# EAGLE design M160C (EAGLE 6.6.0)
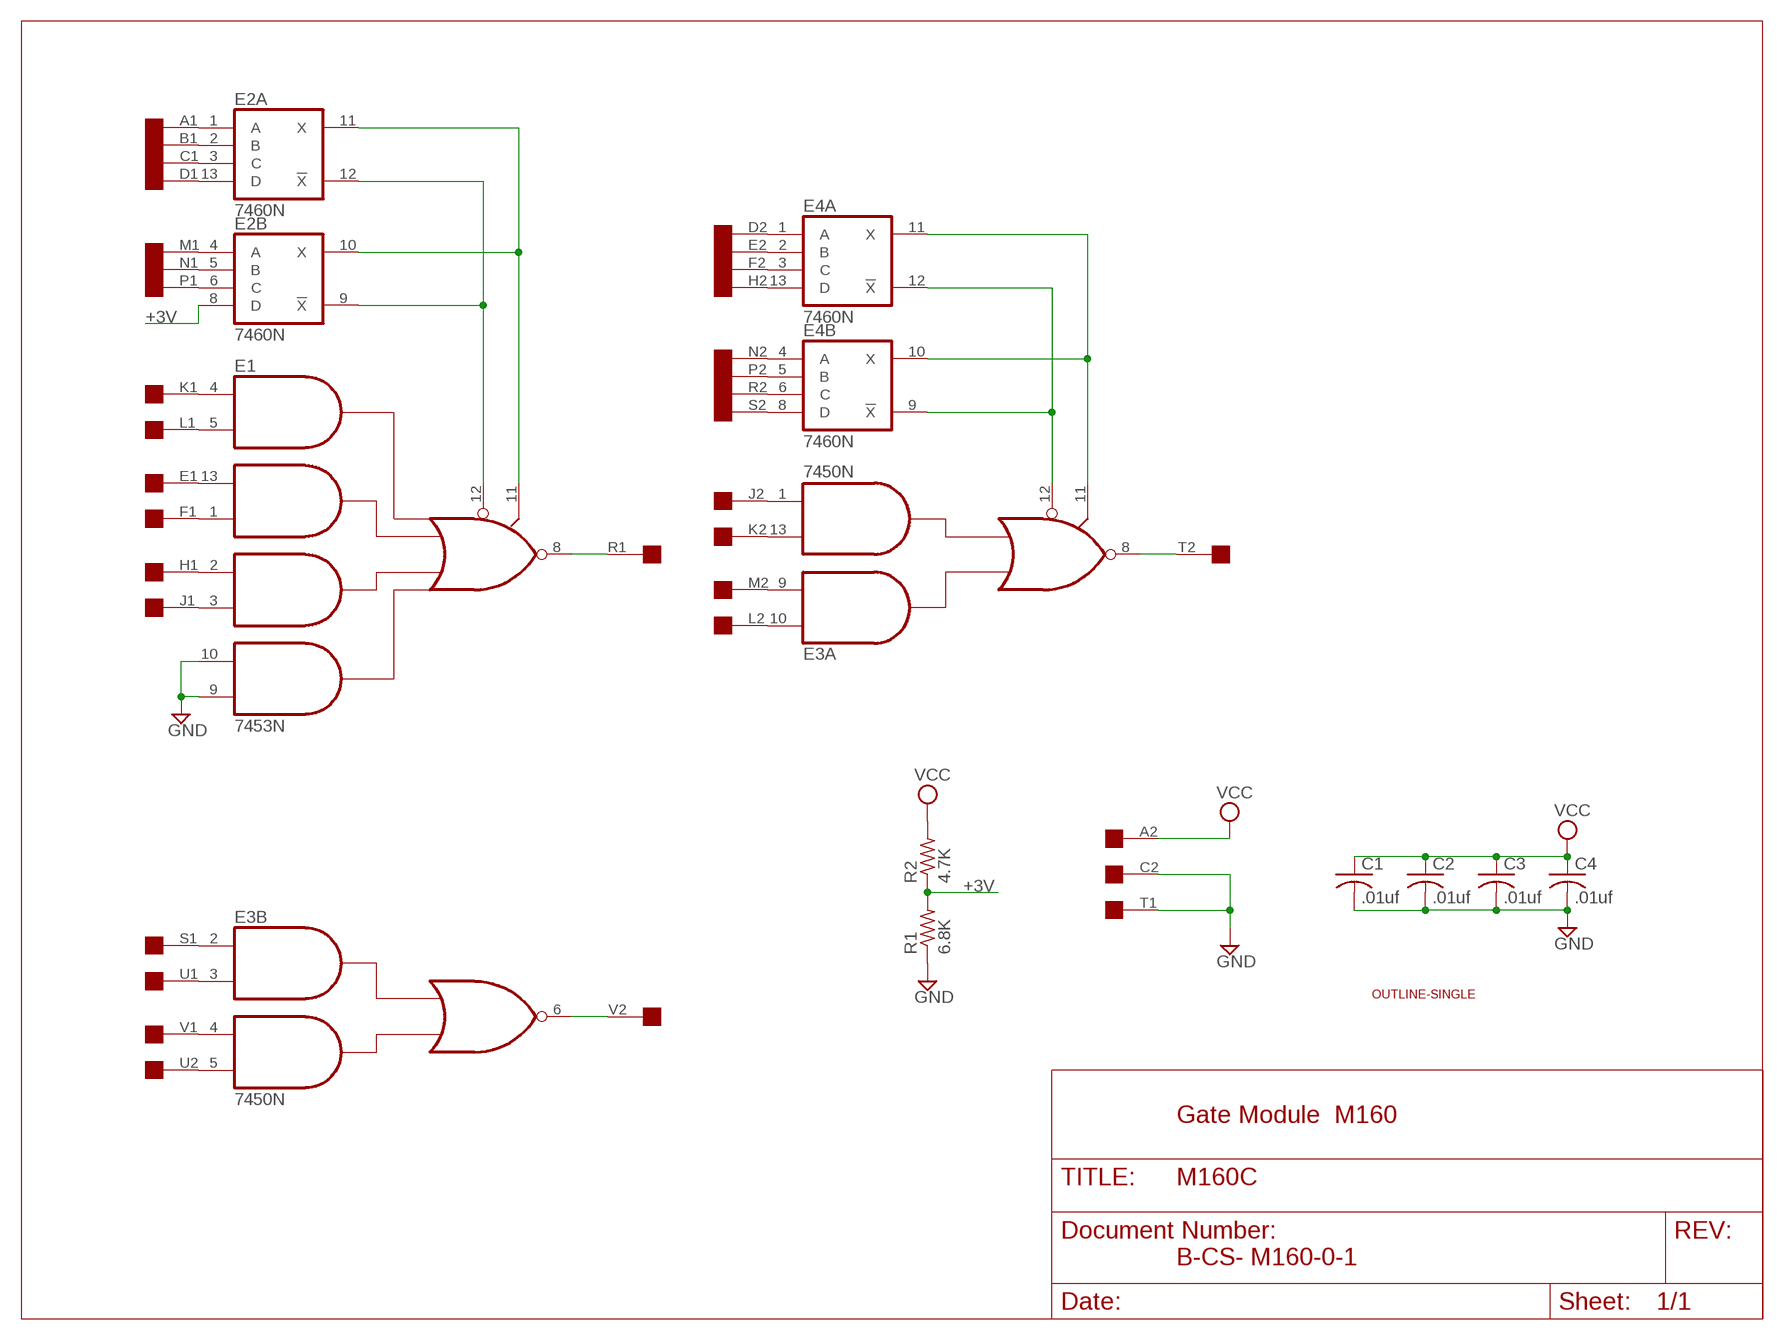
[diagram p0: schematic, sheet 1]

## Parts
C1  .01uf  C-US050-025X075  [C050-025X075]
C2  .01uf  C-US050-025X075  [C050-025X075]
C3  .01uf  C-US050-025X075  [C050-025X075]
C4  .01uf  C-US050-025X075  [C050-025X075]
E1  7453N  [DIL14]
E2  7460N  [DIL14]
E3  7450N  [DIL14]
E4  7460N  [DIL14]
R1  6.8K  R-US_0207/10  [0207/10]
R2  4.7K  R-US_0207/10  [0207/10]
U$1  OUTLINE-SINGLE  [SINGLE]
U$4  SINGLE  [EDGE-CON2]

## Nets
+3V: E2.8(B:D) R1.2 R2.1
GND [Supply]: C1.2 C2.2 C3.2 C4.2 E1.9(I8) E1.10(I7) R1.1 U$4.C2 U$4.T1
N$1: E1.11(I10) E2.10(B:X) E2.11(A:X)
N$2: E1.13(I3) U$4.E1
N$3: E1.1(I4) U$4.F1
N$4: E1.2(I5) U$4.H1
N$5: E1.3(I6) U$4.J1
N$6: E1.4(I1) U$4.K1
N$7: E1.5(I2) U$4.L1
N$8: E1.12(I9) E2.9(B:!X) E2.12(A:!X)
N$9: E2.1(A:A) U$4.A1
N$10: E2.2(A:B) U$4.B1
N$11: E2.3(A:C) U$4.C1
N$12: E2.13(A:D) U$4.D1
N$13: E2.6(B:C) U$4.P1
N$14: E2.5(B:B) U$4.N1
N$15: E2.4(B:A) U$4.M1
N$16: E1.8(O) U$4.R1
N$17: E3.10(A:I1) U$4.L2
N$18: E3.9(A:I2) U$4.M2
N$19: E3.13(A:I3) U$4.K2
N$20: E3.1(A:I4) U$4.J2
N$21: E3.12(A:I5) E4.9(B:!X) E4.12(A:!X)
N$22: E3.11(A:I6) E4.10(B:X) E4.11(A:X)
N$23: E4.3(A:C) U$4.F2
N$24: E4.2(A:B) U$4.E2
N$25: E4.1(A:A) U$4.D2
N$26: E4.13(A:D) U$4.H2
N$27: E4.4(B:A) U$4.N2
N$28: E4.6(B:C) U$4.R2
N$29: E4.8(B:D) U$4.S2
N$30: E4.5(B:B) U$4.P2
N$31: E3.8(A:O) U$4.T2
N$32: E3.2(B:I1) U$4.S1
N$33: E3.5(B:I4) U$4.U2
N$34: E3.4(B:I3) U$4.V1
N$35: E3.3(B:I2) U$4.U1
N$36: E3.6(B:O) U$4.V2
VCC [Supply]: C1.1 C2.1 C3.1 C4.1 R2.2 U$4.A2
Unconnected: E1.6(SPARE) U$4.B2

## Notes on the sheet
- Gate Module  M160
- B-CS- M160-0-1

## Power pins joined to a net without a drawn wire
GND: E1.7(GND) E2.7(P:GND) E3.7(P:GND) E4.7(P:GND)
VCC: E1.14(VCC) E2.14(P:VCC) E3.14(P:VCC) E4.14(P:VCC)

## Library data of the parts
C1-C4 = rcl:C-US: CAPACITOR, American symbol
E1 = dec-con:74*53: 4-2-3-2 input AND OR INVERTER gates
E2 E4 = 74xx-us:74*60: Dual 4-input EXPANDER
E3 = dec-con:74*50: 4-2-3-2 input AND OR INVERTER gates
R1 R2 = rcl:R-US_: RESISTOR, American symbol
U$1 = dec-con:OUTLINE-*: Board outlines for DEC boards.
U$4 = dec-con:SINGLE: Single-Height DEC board

## Net classes
1 Supply: width 0.813 mm

## Board
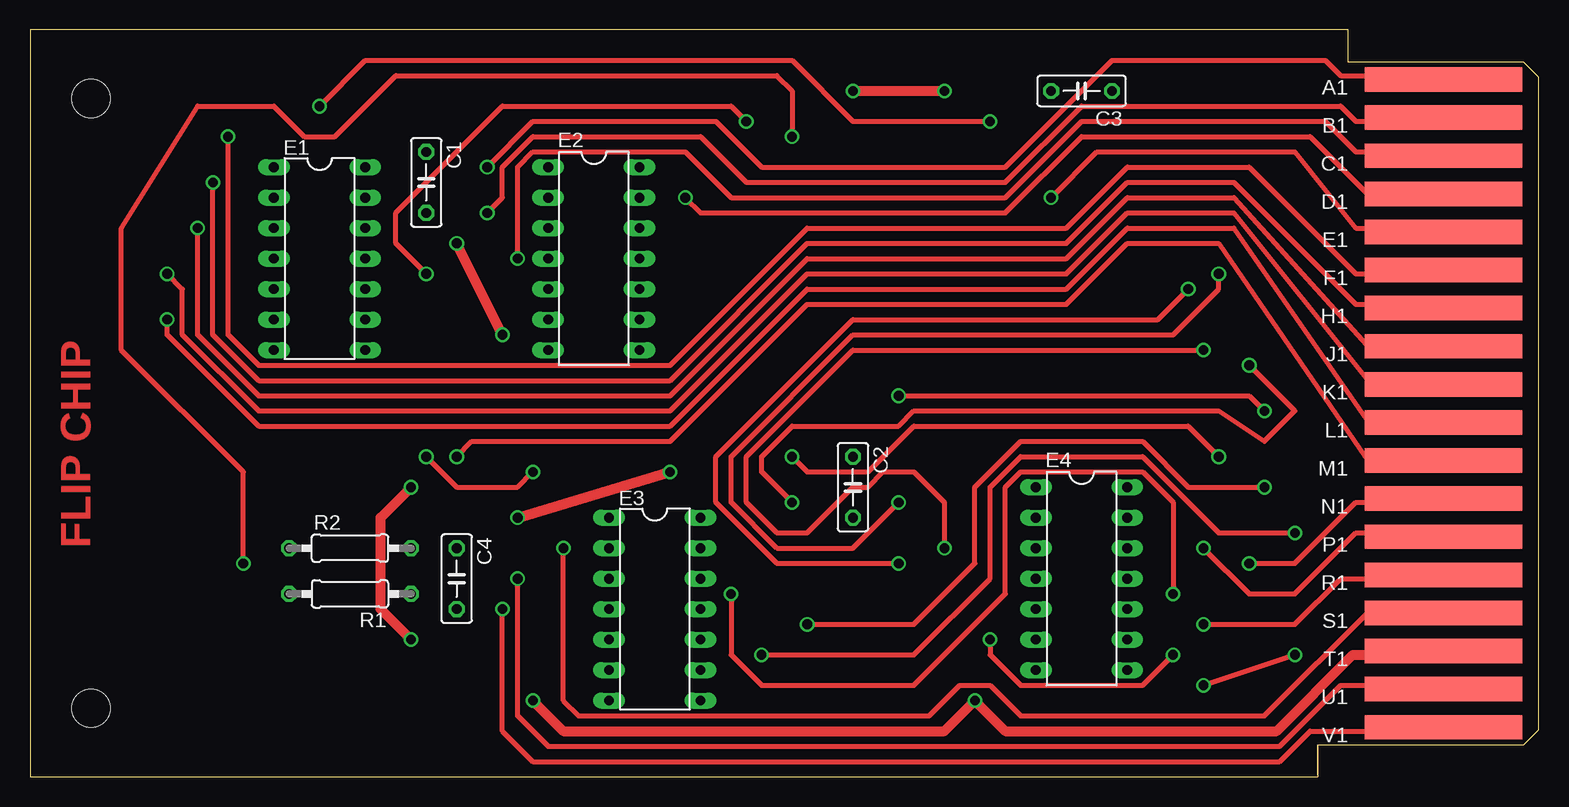
[diagram p1: board, top side]
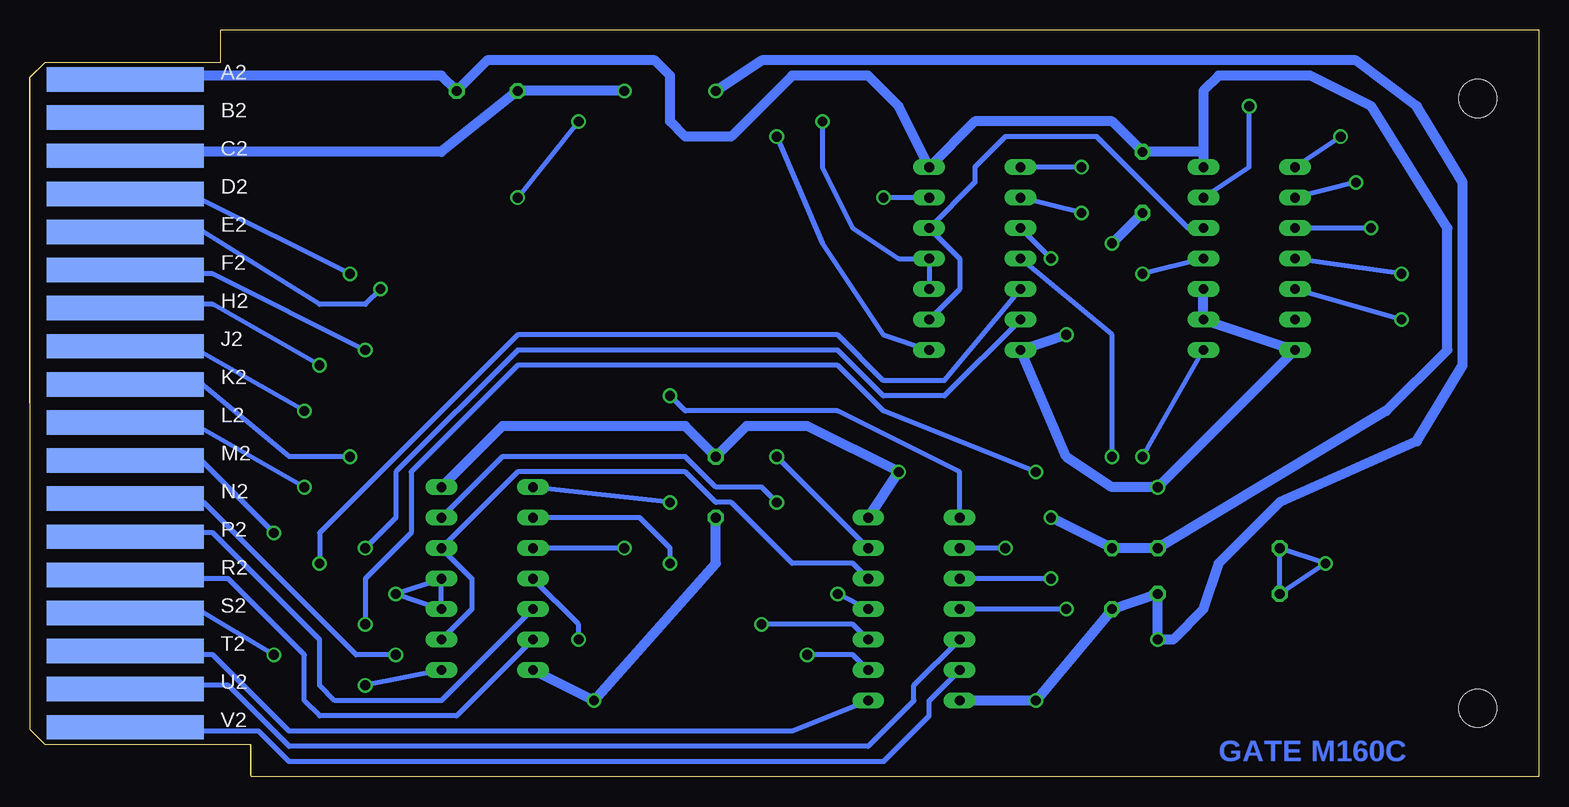
[diagram p2: board, bottom side, seen from below]

Size 125.73 x 62.23 mm. Coordinates in mm from the lower left corner, seen from the top.
Copper layers (1+16): Top 0.035mm / dielectric 1.5mm / Bottom 0.035mm
Design rules "16mils": minimum track width 16mil, minimum drill 32mil, track to track 15mil, track to pad 10mil, pad to pad 10mil, via to via 10mil, smd to smd 10mil, copper to edge 13mil, drill to drill 10mil, minimum pad ring 10mil, minimum via ring 8mil, stop-mask expansion 0mil, vias tented up to drill 0mil, thermal gap 10mil

### Footprints (pad centres in the part's own frame; a part is rotated, then mirrored left to right if it is on the bottom)
C050-025X075 = drill 0.813 octagon: 1 -2.54,0; 2 2.54,0
DIL14 = drill 0.813 long: 1 -7.62,-3.81; 2 -5.08,-3.81; 3 -2.54,-3.81; 4 0,-3.81; 5 2.54,-3.81; 6 5.08,-3.81; 7 7.62,-3.81; 8 7.62,3.81; 9 5.08,3.81; 10 2.54,3.81; 11 0,3.81; 12 -2.54,3.81; 13 -5.08,3.81; 14 -7.62,3.81
0207/10 = drill 0.813 octagon: 1 -5.08,0; 2 5.08,0
SINGLE = hole 3.175: 120.65,56.515; 120.65,5.715
EDGE-CON2 = smd 13.106 x 2.032: A1 7.938,4.128; B1 7.938,7.303; C1 7.938,10.477; D1 7.938,13.652; E1 7.938,16.828; F1 7.938,20.003; H1 7.938,23.177; J1 7.938,26.352; K1 7.938,29.527; L1 7.938,32.703; M1 7.938,35.877; N1 7.938,39.053; P1 7.938,42.227; R1 7.938,45.403; S1 7.938,48.578; T1 7.938,51.752; U1 7.938,54.928; V1 7.938,58.102 | smd 13.106 x 2.032 bottom: A2 7.938,4.128; B2 7.938,7.303; C2 7.938,10.477; D2 7.938,13.652; E2 7.938,16.828; F2 7.938,20.003; H2 7.938,23.177; J2 7.938,26.352; K2 7.938,29.527; L2 7.938,32.703; M2 7.938,35.877; N2 7.938,39.053; P2 7.938,42.227; R2 7.938,45.403; S2 7.938,48.578; T2 7.938,51.752; U2 7.938,54.928; V2 7.938,58.102

### Placement (x,y rotation side)
C1  33.02,49.53 270 top
C2  68.58,24.13 270 top
C3  87.63,57.15 180 top
C4  35.56,16.51 270 top
E1  24.13,43.18 270 top
E2  46.99,43.18 270 top
E3  52.07,13.97 270 top
E4  87.63,16.51 270 top
R1  26.67,15.24 180 top
R2  26.67,19.05 0 top
U$1  125.73,62.23 180 top
U$2  [FLIPCHIP]  0,0 0 top
U$4  125.73,62.23 180 top

### Tracks (layer width: path | path; a pad name or v marks a point on that pad's centre or on a via)
+3V  (via drill 0.81)
  Top 0.406: v63.5,53.34 63.5,57.15 62.23,58.42 30.48,58.42 25.4,53.34 22.86,53.34 20.32,55.88 13.97,55.88 7.62,45.72 7.62,35.56 17.78,25.4 v17.78,17.78
  Bottom 0.406: E2.8 54.61,36.83 59.69,44.45 v63.5,53.34 | R1.2 v17.78,17.78 R2.1 R1.2
GND  (via drill 0.81)
  Top 0.813: v68.58,57.15 v76.2,57.15 | v39.37,36.83 v35.56,44.45 | v31.75,24.13 29.21,21.59 29.21,13.97 v31.75,11.43 | v41.91,6.35 44.45,3.81 76.2,3.81 v78.74,6.35 81.28,3.81 103.89,3.81 110.24,10.16 116.84,10.16 U$4.T1
  Bottom 0.813: U$4.C2 117.78,52.07 91.44,52.07 C3.2 v76.2,57.15 | v68.58,57.15 64.77,59.69 15.24,59.69 10.16,55.88 6.35,49.53 6.35,34.29 10.16,27.94 21.59,22.86 26.67,17.78 27.94,13.97 30.48,11.43 v31.75,11.43 R1.1 C4.2 v41.91,6.35 E3.7 | E1.10 E1.9 E1.7 v31.75,24.13 35.56,24.13 39.37,26.67 E2.7 v39.37,36.83 | v35.56,44.45 C1.2 | E4.7 v78.74,6.35 68.58,17.78 C2.2
N$1  (via drill 0.81)
  Top 0.406: v33.02,41.91 30.48,44.45 30.48,46.99 39.37,55.88 58.42,55.88 v59.69,54.61
  Bottom 0.406: E1.11 v33.02,41.91 | v59.69,54.61 59.69,50.8 57.15,45.72 53.34,43.18 E2.11 E2.10
N$2  (via drill 0.81)
  Top 0.406: v24.13,55.88 27.94,59.69 63.5,59.69 68.58,54.61 v80.01,54.61 | v85.09,48.26 88.9,52.07 105.41,52.07 110.49,45.72 116.84,45.72 U$4.E1
  Bottom 0.406: E1.13 24.13,50.8 v24.13,55.88 | v80.01,54.61 v85.09,48.26
N$3  (via drill 0.81)
  Top 0.406: v16.51,53.34 16.51,36.83 19.05,34.29 53.34,34.29 64.77,45.72 86.36,45.72 91.44,50.8 101.6,50.8 110.49,41.91 116.84,41.91 U$4.F1
  Bottom 0.406: v16.51,53.34 E1.1
N$4  (via drill 0.81)
  Top 0.406: v15.24,49.53 15.24,36.83 19.05,33.02 53.34,33.02 64.77,44.45 86.36,44.45 91.44,49.53 100.33,49.53 110.49,39.37 116.84,39.37 U$4.H1
  Bottom 0.406: v15.24,49.53 E1.2
N$5  (via drill 0.81)
  Top 0.406: v13.97,45.72 13.97,36.83 19.05,31.75 53.34,31.75 64.77,43.18 86.36,43.18 91.44,48.26 100.33,48.26 111.76,35.56 115.57,35.56 U$4.J1
  Bottom 0.406: v13.97,45.72 E1.3
N$6  (via drill 0.81)
  Top 0.406: v11.43,41.91 12.7,40.64 12.7,36.83 19.05,30.48 53.34,30.48 64.77,41.91 86.36,41.91 91.44,46.99 100.33,46.99 111.51,33.02 116.84,33.02 U$4.K1
  Bottom 0.406: v11.43,41.91 E1.4
N$7  (via drill 0.81)
  Top 0.406: U$4.L1 116.84,29.21 111.76,29.21 100.33,45.72 91.44,45.72 86.36,40.64 64.77,40.64 53.34,29.21 19.05,29.21 11.43,36.83 v11.43,38.1
  Bottom 0.406: v11.43,38.1 E1.5
N$8
  Bottom 0.406: E1.12 29.21,45.72 36.83,53.34 44.45,53.34 46.99,50.8 46.99,49.53 E2.12 48.26,43.18 48.26,40.64 E2.9
N$9  (via drill 0.81)
  Top 0.406: v38.1,50.8 41.91,54.61 57.15,54.61 60.96,50.8 81.28,50.8 90.17,59.69 107.95,59.69 109.22,58.42 116.84,58.42 117.24,58.02 U$4.A1
  Bottom 0.406: v38.1,50.8 E2.1
N$10  (via drill 0.81)
  Top 0.406: v38.1,46.99 39.37,48.26 39.37,50.8 41.91,53.34 55.88,53.34 59.69,49.53 81.28,49.53 87.63,55.88 109.22,55.88 110.49,54.61 111.76,54.61 116.84,54.61 117.13,54.9 U$4.B1
  Bottom 0.406: v38.1,46.99 E2.2
N$11  (via drill 0.81)
  Top 0.406: v40.64,43.18 40.64,50.8 41.91,52.07 54.61,52.07 58.42,48.26 81.28,48.26 87.63,54.61 107.95,54.61 110.49,52.07 116.84,52.07 117.17,51.74 U$4.C1
  Bottom 0.406: v40.64,43.18 E2.3
N$12  (via drill 0.81)
  Top 0.406: v54.61,48.26 55.88,46.99 81.28,46.99 87.63,53.34 106.68,53.34 111.76,48.26 116.84,48.26 117.14,48.56 U$4.D1
  Bottom 0.406: E2.13 v54.61,48.26
N$13  (via drill 0.81)
  Top 0.406: U$4.P1 116.84,20.32 110.49,20.32 105.41,15.24 101.6,15.24 v97.79,19.05
  Bottom 0.406: v97.79,19.05 95.25,21.59 95.25,25.4 85.09,35.56 58.42,35.56 54.61,31.75 49.53,31.75 E2.6
N$14  (via drill 0.81)
  Top 0.406: U$4.N1 117.17,23.19 116.84,22.86 110.49,22.86 105.41,17.78 v101.6,17.78
  Bottom 0.406: E2.5 49.53,33.02 54.61,33.02 58.42,36.83 85.09,36.83 101.6,20.32 v101.6,17.78
N$15  (via drill 0.81)
  Top 0.406: v35.56,26.67 36.83,27.94 53.34,27.94 64.77,39.37 86.36,39.37 91.44,44.45 99.06,44.45 111.25,26.67 116.84,26.67 117.17,26.34 U$4.M1
  Bottom 0.406: E2.4 35.56,36.83 v35.56,26.67
N$16  (via drill 0.81)
  Top 0.406: v33.02,26.67 35.56,24.13 40.64,24.13 v41.91,25.4 | U$4.R1 116.84,16.51 109.22,16.51 105.41,12.7 v97.79,12.7
  Bottom 0.406: v33.02,26.67 E1.8 | v41.91,25.4 54.61,30.48 58.42,34.29 85.09,34.29 93.98,25.4 93.98,20.32 97.79,16.51 v97.79,12.7
N$17  (via drill 0.81)
  Top 0.406: v64.77,12.7 73.66,12.7 78.74,17.78 78.74,24.13 82.55,27.94 92.71,27.94 96.52,24.13 v102.87,24.13
  Bottom 0.406: E3.10 57.15,12.7 v64.77,12.7 | U$4.L2 116.84,29.21 111.76,29.21 v102.87,24.13
N$18  (via drill 0.81)
  Top 0.406: v60.96,10.16 73.66,10.16 80.01,16.51 80.01,24.13 82.55,26.67 92.71,26.67 99.06,20.32 v105.41,20.32
  Bottom 0.406: E3.9 57.15,10.16 v60.96,10.16 | U$4.M2 116.84,26.67 111.76,26.67 v105.41,20.32
N$19  (via drill 0.81)
  Top 0.406: v63.5,26.67 64.77,25.4 69.85,25.4 73.66,29.21 96.52,29.21 v99.06,26.67
  Bottom 0.406: E3.13 v63.5,26.67 | U$4.K2 116.84,33.02 111.76,33.02 104.14,26.67 v99.06,26.67
N$20  (via drill 0.81)
  Top 0.406: v102.87,30.48 101.6,31.75 v72.39,31.75
  Bottom 0.406: E3.1 48.26,25.4 58.42,30.48 71.12,30.48 v72.39,31.75 | U$4.J2 116.84,35.56 111.76,35.56 v102.87,30.48
N$21
  Bottom 0.406: E3.12 57.15,17.78 62.23,17.78 67.31,22.86 68.58,22.86 71.12,25.4 85.09,25.4 E4.12 88.9,16.51 88.9,13.97 E4.9
N$22  (via drill 0.81)
  Top 0.406: v58.42,15.24 58.42,10.16 60.96,7.62 73.66,7.62 81.28,15.24 81.28,24.13 82.55,25.4 92.71,25.4 95.25,22.86 v95.25,15.24
  Bottom 0.406: E3.11 v58.42,15.24 | E4.10 E4.11 v95.25,15.24 E4.10
N$23  (via drill 0.81)
  Top 0.406: v97.79,35.56 68.58,35.56 59.69,26.67 59.69,22.86 62.23,20.32 64.77,20.32 68.58,24.13 69.85,24.13 71.12,25.4 73.66,25.4 76.2,22.86 v76.2,19.05
  Bottom 0.406: U$4.F2 116.84,41.91 110.49,41.91 v97.79,35.56 | v76.2,19.05 E4.3
N$24  (via drill 0.81)
  Top 0.406: v96.52,40.64 93.98,38.1 68.58,38.1 57.15,26.67 57.15,22.86 62.23,17.78 v72.39,17.78
  Bottom 0.406: E4.2 74.93,21.59 72.39,19.05 v72.39,17.78 | U$4.E2 116.84,45.72 111.76,45.72 101.6,39.37 97.79,39.37 v96.52,40.64
N$25  (via drill 0.81)
  Top 0.406: v99.06,41.91 99.06,40.64 95.25,36.83 68.58,36.83 58.42,26.67 58.42,22.86 62.23,19.05 68.58,19.05 v72.39,22.86
  Bottom 0.406: v72.39,22.86 E4.1 | U$4.D2 117.78,48.26 111.76,48.26 v99.06,41.91
N$26  (via drill 0.81)
  Top 0.406: v101.6,34.29 105.41,30.48 102.87,27.94 99.06,30.48 73.66,30.48 72.39,29.21 63.5,29.21 60.96,26.67 60.96,25.4 v63.5,22.86
  Bottom 0.406: E4.13 86.36,26.67 71.12,26.67 68.58,24.13 64.77,24.13 v63.5,22.86 | U$4.H2 116.84,39.37 110.49,39.37 v101.6,34.29
N$27  (via drill 0.81)
  Top 0.406: v95.25,10.16 92.71,7.62 82.55,7.62 80.01,10.16 v80.01,11.43
  Bottom 0.406: E4.4 80.01,12.7 v80.01,11.43 | U$4.N2 116.84,22.86 111.25,22.86 98.55,10.16 v95.25,10.16
N$28
  Bottom 0.406: U$4.R2 117.76,16.51 109.22,16.51 102.87,10.16 102.87,6.35 101.6,5.08 90.17,5.08 E4.6
N$29  (via drill 0.81)
  Top 0.406: v97.79,7.62 v105.41,10.16
  Bottom 0.406: E4.8 v97.79,7.62 | U$4.S2 116.84,13.97 111.76,13.97 v105.41,10.16
N$30
  Bottom 0.406: E4.5 91.44,6.35 100.33,6.35 101.6,7.62 101.6,11.43 110.49,20.32 117.76,20.32 U$4.P2
N$31
  Bottom 0.406: E3.8 62.23,3.81 104.14,3.81 110.49,10.16 117.76,10.16 U$4.T2
N$32  (via drill 0.81)
  Top 0.406: U$4.S1 116.84,13.97 111.76,13.97 102.87,5.08 82.55,5.08 80.01,7.62 77.47,7.62 74.93,5.08 45.72,5.08 44.45,6.35 v44.45,19.05
  Bottom 0.406: v44.45,19.05 E3.2
N$33
  Bottom 0.406: U$4.U2 117.73,7.62 109.22,7.62 104.14,2.54 55.88,2.54 52.07,6.35 52.07,7.62 E3.5
N$34  (via drill 0.81)
  Top 0.406: U$4.V1 116.84,3.81 106.68,3.81 104.14,1.27 41.91,1.27 39.37,3.81 v39.37,13.97
  Bottom 0.406: v39.37,13.97 E3.4
N$35  (via drill 0.81)
  Top 0.406: U$4.U1 116.84,7.62 109.22,7.62 104.14,2.54 43.18,2.54 40.64,5.08 v40.64,16.51
  Bottom 0.406: v40.64,16.51 E3.3
N$36
  Bottom 0.406: E3.6 50.8,6.35 50.8,5.08 54.61,1.27 104.14,1.27 106.68,3.81 117.69,3.81 U$4.V2
VCC  (via drill 0.81)
  Top 0.813: v40.64,21.59 v53.34,25.4
  Bottom 0.813: U$4.A2 117.72,58.42 91.44,58.42 C3.1 87.63,59.69 73.66,59.69 72.39,58.42 72.39,54.61 71.12,53.34 67.31,53.34 62.23,58.42 55.88,58.42 53.34,55.88 E2.14 46.99,54.61 35.56,54.61 C1.1 27.94,52.07 | 27.94,52.07 E1.14 | 27.94,52.07 27.94,57.15 26.67,58.42 19.05,58.42 13.97,55.88 7.62,45.72 7.62,35.56 12.7,30.48 R2.2 C4.1 v40.64,21.59 | E3.14 v53.34,25.4 60.96,29.21 66.04,29.21 C2.1 71.12,29.21 86.36,29.21 E4.14

### Text on the board
Bottom: GATE M160C